# Altium schematic sheet CHARGING IC.SchDoc
size A4; SheetNumber: 3; SheetTotal: 8
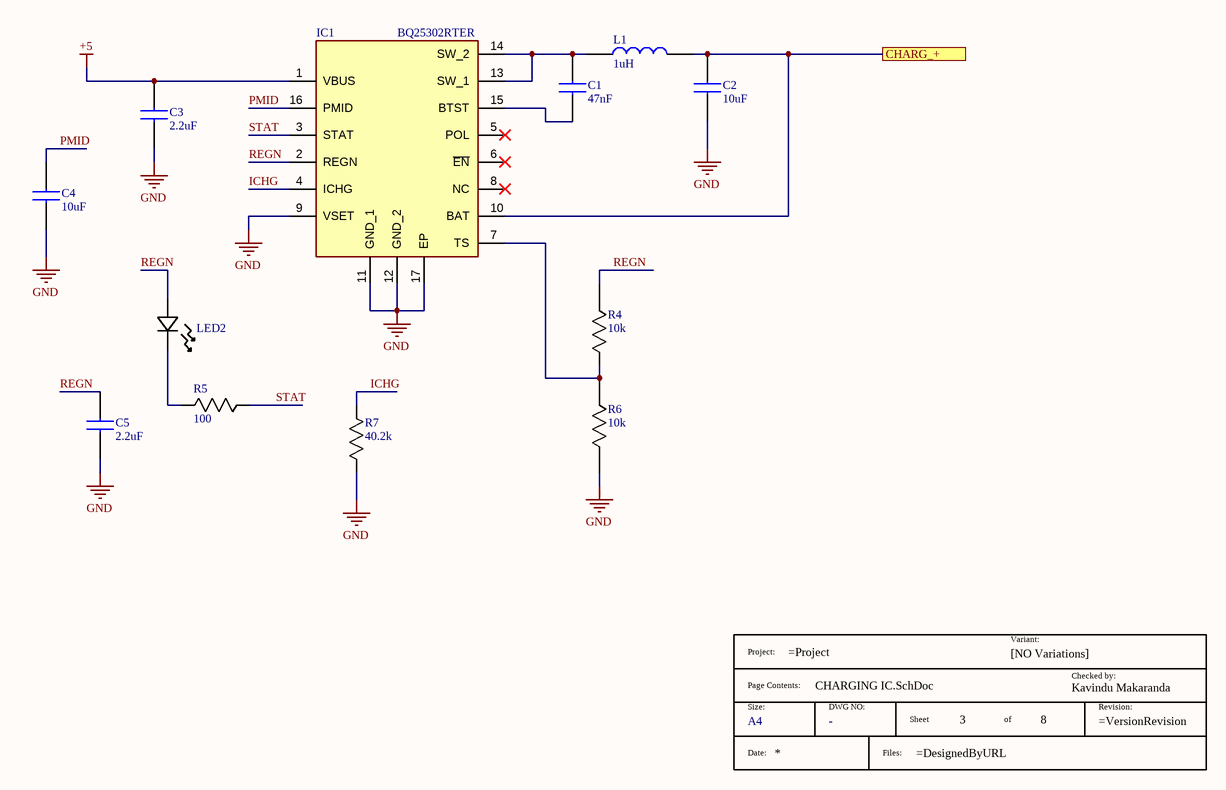
[diagram p0: CHARGING IC.SchDoc]

## Parts
*?  Size: A4  (hidden comment: TitleBlock)  (graphical)
C1  47nF  [C0603]
C2  10uF  [CAPC1608X90N]
C3  2.2uF  [CAPC1608X90N]
C4  10uF  [CAPC1608X90N]
C5  2.2uF  [CAPC1608X90N]
IC1  BQ25302RTER  [QFN50P300X300X80-17N-D]
L1  1uH  [INDC2016X100N]
LED2  LED GREEN DIFFUSED 0603 SMD  [LED_B1931NG_HVK]  (value not drawn)
R4  10k  [RESC1608X55N]
R5  100  [RESC1608X55N]
R6  10k  [RESC1608X55N]
R7  40.2k  [STA_RMCF0805_STP-L]

## Ports
CHARG_+ (see Main_sch[3A], BATTERY[2B], FUEL GAUGE IC[4B])

## Nets
+5: C3.2 IC1.1(VBUS)
GND: C2.1 C3.1 C4.1 C5.1 IC1.9(VSET) IC1.11(GND_1) IC1.12(GND_2) IC1.17(EP) R6.1 R7.1
CHARG_+: C2.2 IC1.10(BAT) L1.2 ; port CHARG_+
ICHG: IC1.4(ICHG) R7.2
PMID: C4.2 IC1.16(PMID)
REGN: C5.2 IC1.2(REGN) LED2.2(ANODE) R4.2
STAT: IC1.3(STAT) R5.2
NetC1_1: C1.1 IC1.15(BTST)
NetC1_2: C1.2 IC1.13(SW_1) IC1.14(SW_2) L1.1
NetIC1_7: IC1.7(TS) R4.1 R6.2
NetLED2_1: LED2.1(CATHODE) R5.1

Not connected (* = marked no-connect by the designer): IC1 5(POL)* 6(~{EN})* 8(NC)*

## Notes on the sheet
- THIS DOCUMENT AND THE DATA DISCLOSED HEREIN OR
- HEREWITH IS THE PROPERTY OF ALTIUM LIMITED AND MAY
- DWG NO:
- REVISION
- REV:
- DESCRIPTION
- DATE
- APPROVED
- BE FREELY DISTRIBUTED IN WHOLE. NO RIGHTS ARE
- RESERVED OR EXPRESS OR IMPLIED WARANTEE GIVEN.
- ENG:
- APPROVALS
- PROJECT
- DSN:
- CHK:
- REFERENCE DOCUMENTS
- PROJECT REVISION:
- TITLE
- DOCUMENT REVISION:
- DESIGN ITEM:
- BOM:
- FAB DWG:
- PCB DWG:
- ASSY DWG:
- SCALE:
- A3
- SIZE
- CAGE CODE
- FILE NAME
- DWG NO.
- SHEET
- OF
- REV
- (in symbol TitleBlock) Variant:; Project:; [NO Variations]; Checked by:; Page Contents:; Kavindu Makaranda; Size:; DWG NO:; Revision:; Sheet; of; Date:; Files:

## Library data of the parts
*? = TitleBlock: Standard Title Block; DWG NO: -
C1 = C0603C473K4RECAUTO: Manufacturer_Name: KEMET; Datasheet Link: https://content.kemet.com/datasheets/KEM_C1090_X7R_ESD.pdf; Height: 0.87mm; Manufacturer_Part_Number: C0603C473K4RECAUTO; Mouser Part Number: 80-C0603C473K4RECAUT; Mouser Price/Stock: https://www.mouser.co.uk/ProductDetail/KEMET/C0603C473K4RECAUTO?qs=MLItCLRbWsx7WtjsOHG43w%3D%3D; Supplier 1: Arrow Electronics; Supplier Part Number 1: C0603C473K4RECAUTO
C2 C4 = CL10A106KQ8NNNC: Manufacturer_Name: SAMSUNG; Datasheet Link: https://ms.componentsearchengine.com/Datasheets/2/CL10A106KQ8NNNC.pdf; Height: 0.9mm; Manufacturer_Part_Number: CL10A106KQ8NNNC; Mouser Part Number: 187-CL10A106KQ8NNNC; Mouser Price/Stock: https://www.mouser.co.uk/ProductDetail/Samsung-Electro-Mechanics/CL10A106KQ8NNNC?qs=349EhDEZ59o8RdV9CD4bGw%3D%3D; Arrow Part Number: CL10A106KQ8NNNC; Arrow Price/Stock: https://www.arrow.com/en/products/cl10a106kq8nnnc/samsung-electro-mechanics?utm_currency=USD&region=nac; Supplier 1: Digikey; Supplier Part Number 1: 1276-1038-1-ND
C3 C5 = CL10A225KO8NNNC: Manufacturer_Name: SAMSUNG; Datasheet Link: https://lcsc.componentsearchengine.com/Datasheets/2/CL10A225KO8NNNC.pdf; Height: 0.9mm; Manufacturer_Part_Number: CL10A225KO8NNNC; Mouser Part Number: 187-CL10A225KO8NNNC; Mouser Price/Stock: https://www.mouser.co.uk/ProductDetail/Samsung-Electro-Mechanics/CL10A225KO8NNNC?qs=hqM3L16%252BxlecoJxUp5hKOw%3D%3D; Arrow Part Number: CL10A225KO8NNNC; Arrow Price/Stock: https://www.arrow.com/en/products/cl10a225ko8nnnc/samsung-electro-mechanics?region=europe; Supplier 1: Digikey; Supplier Part Number 1: 1276-1040-1-ND
IC1 = BQ25302RTER: Integrated Circuit; Manufacturer_Name: Texas Instruments; Datasheet Link: https://www.ti.com/lit/gpn/bq25302?HQS=ti-null-null-sf-df-pf-sep-wwe&DCM=yes; Height: 0.8mm; Manufacturer_Part_Number: BQ25302RTER; Mouser Part Number: 595-BQ25302RTER; Mouser Price/Stock: https://www.mouser.co.uk/ProductDetail/Texas-Instruments/BQ25302RTER?qs=T94vaHKWudT5T0v43I60Mg%3D%3D; Arrow Part Number: BQ25302RTER; Arrow Price/Stock: null?region=nac; Supplier 1: Mouser; Supplier Part Number 1: 595-BQ25302RTER
L1 = CIGT201610LH1R0MNE: Manufacturer_Name: SAMSUNG; Datasheet Link: https://datasheet.datasheetarchive.com/originals/distributors/DKDS-19/372470.pdf; Height: 1mm; Manufacturer_Part_Number: CIGT201610LH1R0MNE; Mouser Part Number: 187-CIGT201610LH1R0M; Mouser Price/Stock: https://www.mouser.co.uk/ProductDetail/Samsung-Electro-Mechanics/CIGT201610LH1R0MNE?qs=xZ%2FP%252Ba9zWqYdDsZ4M%252BqcTg%3D%3D; Arrow Part Number: CIGT201610LH1R0MNE; Arrow Price/Stock: https://www.arrow.com/en/products/cigt201610lh1r0mne/samsung-electro-mechanics?utm_currency=USD&region=nac; Supplier 1: Digikey; Supplier Part Number 1: 1276-6910-1-ND
LED2 = B1931NG--20D001114U1930: Mfr_Name: Harvatek; Type: LED Indication; Supplier 1: Digikey; Supplier Part Number 1: 3147-B1931NG--20D001114U1930CT-ND
R4 R6 = RK73H1JTTD1002F: Manufacturer_Name: KOA Speer; Datasheet Link: http://www.koaspeer.com/catimages/Products/RK73-RT/RK73-RT.pdf; Height: 0.55mm; Manufacturer_Part_Number: RK73H1JTTD1002F; Mouser Part Number: 660-RK73H1JTTD1002F; Mouser Price/Stock: https://www.mouser.co.uk/ProductDetail/KOA-Speer/RK73H1JTTD1002F?qs=%252BHd4ebZ%252Bq6V15kIYdKv25A%3D%3D; Arrow Part Number: RK73H1JTTD1002F; Arrow Price/Stock: https://www.arrow.com/en/products/rk73h1jttd1002f/koa-speer-electronics?region=nac; Supplier 1: Digikey; Supplier Part Number 1: 2019-RK73H1JTTD1002FCT-ND
R5 = ERJ-3EKF1000V: Resistor ERJ-3EKF1000V; Manufacturer_Name: Panasonic; Datasheet Link: http://industrial.panasonic.com/cdbs/www-data/pdf/RDA0000/AOA0000C86.pdf; Height: 0.55mm; Manufacturer_Part_Number: ERJ-3EKF1000V; Mouser Part Number: 667-ERJ-3EKF1000V; Mouser Price/Stock: https://www.mouser.co.uk/ProductDetail/Panasonic/ERJ-3EKF1000V?qs=H7k1u0Mp9JS7i8KGO5m47A%3D%3D; Arrow Part Number: ERJ-3EKF1000V; Arrow Price/Stock: https://www.arrow.com/en/products/erj-3ekf1000v/panasonic?utm_currency=USD&region=nac; Supplier 1: Mouser; Supplier Part Number 1: 667-ERJ-3EKF1000V
R7 = RMCF0805FT40K2: Mfr_Name: Stackpole International; Supplier 1: Digikey; Supplier Part Number 1: RMCF0805FT40K2CT-ND